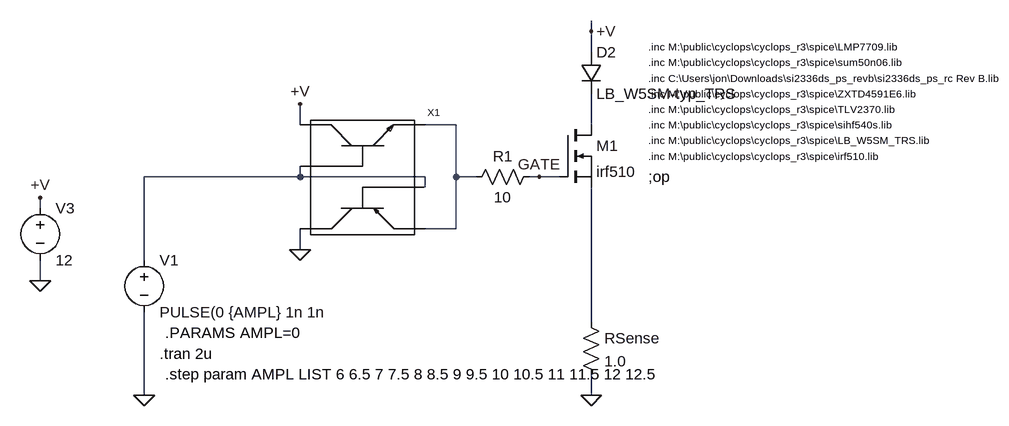
[diagram p0: schematic cyclops_r3.6_feedback-factor.asc]
cyclops_r3.6_feedback-factor.asc, the LTspice schematic file:
Version 4
SHEET 1 1460 980
WIRE 160 -48 160 -64
WIRE 160 -16 160 -48
WIRE -288 96 -288 64
WIRE -48 96 -96 96
WIRE 160 96 160 48
WIRE -288 176 -288 160
WIRE -288 176 -528 176
WIRE -96 176 -288 176
WIRE -48 176 -48 96
WIRE -16 176 -48 176
WIRE 80 176 64 176
WIRE 112 176 80 176
WIRE -96 192 -96 176
WIRE -688 224 -688 208
WIRE -48 256 -48 176
WIRE -48 256 -96 256
WIRE -288 288 -288 256
WIRE -528 304 -528 176
WIRE -688 336 -688 304
WIRE 160 400 160 192
WIRE -528 512 -528 384
WIRE 160 512 160 480
FLAG 160 512 0
FLAG -528 512 0
FLAG -688 336 0
FLAG -688 208 +V
FLAG 160 -48 +V
FLAG -288 64 +V
FLAG -288 288 0
FLAG 80 176 GATE
SYMBOL nmos 112 96 R0
SYMATTR InstName M1
SYMATTR Value irf510
SYMATTR Prefix X
SYMBOL res 144 384 R0
SYMATTR InstName RSense
SYMATTR Value 1.0
SYMATTR SpiceLine pwr=20
SYMBOL voltage -528 288 R0
WINDOW 123 0 0 Left 2
WINDOW 39 0 0 Left 2
SYMATTR InstName V1
SYMATTR Value PULSE(0 {AMPL} 1n 1n
SYMBOL voltage -688 208 R0
WINDOW 123 0 0 Left 2
WINDOW 39 0 0 Left 2
SYMATTR InstName V3
SYMATTR Value 12
SYMBOL ZXTD45 -192 176 R0
SYMATTR InstName X1
SYMATTR Prefix X
SYMATTR Value ZXTD4591E6
SYMBOL res 80 160 R90
WINDOW 0 0 56 VBottom 2
WINDOW 3 32 56 VTop 2
SYMATTR InstName R1
SYMATTR Value 10
SYMBOL diode 144 -16 R0
SYMATTR InstName D2
SYMATTR Value LB_W5SM-typ_TRS
TEXT 248 96 Left 1 !.inc M:\\public\\cyclops\\cyclops_r3\\spice\\sihf540s.lib
TEXT 248 176 Left 2 !;op
TEXT 248 120 Left 1 !.inc M:\\public\\cyclops\\cyclops_r3\\spice\\LB_W5SM_TRS.lib
TEXT 248 72 Left 1 !.inc M:\\public\\cyclops\\cyclops_r3\\spice\\TLV2370.lib
TEXT 248 48 Left 1 !.inc M:\\public\\cyclops\\cyclops_r3\\spice\\ZXTD4591E6.lib
TEXT 248 144 Left 1 !.inc M:\\public\\cyclops\\cyclops_r3\\spice\\irf510.lib
TEXT 248 24 Left 1 !.inc C:\\Users\\jon\\Downloads\\si2336ds_ps_revb\\si2336ds_ps_rc Rev B.lib
TEXT 248 0 Left 1 !.inc M:\\public\\cyclops\\cyclops_r3\\spice\\sum50n06.lib
TEXT 248 -24 Left 1 !.inc M:\\public\\cyclops\\cyclops_r3\\spice\\LMP7709.lib
TEXT -496 416 Left 2 !.PARAMS AMPL=0
TEXT -504 448 Left 2 !.tran 2u
TEXT -496 480 Left 2 !.step param AMPL LIST 6 6.5 7 7.5 8 8.5 9 9.5 10 10.5 11 11.5 12 12.5

The netlist it stands for:
* cyclops_r3.6_feedback-factor.asc
XM1 N002 GATE N004 irf510  ; pins D G S
RSense N004 0 1.0 pwr=20
V1 N003 0 PULSE(0 {AMPL} 1n 1n
V3 +V 0 12
XX1 +V N003 0 N001 N003 N001 ZXTD45 params: ZXTD4591E6  ; pins C1 B1 C2 E2 B2 E1
R1 GATE N001 10
D2 +V N002 LB_W5SM-typ_TRS
.model D D
.lib standard.dio
.inc M:\public\cyclops\cyclops_r3\spice\sihf540s.lib
;op
.inc M:\public\cyclops\cyclops_r3\spice\LB_W5SM_TRS.lib
.inc M:\public\cyclops\cyclops_r3\spice\TLV2370.lib
.inc M:\public\cyclops\cyclops_r3\spice\ZXTD4591E6.lib
.inc M:\public\cyclops\cyclops_r3\spice\irf510.lib
.inc C:\Users\jon\Downloads\si2336ds_ps_revb\si2336ds_ps_rc Rev B.lib
.inc M:\public\cyclops\cyclops_r3\spice\sum50n06.lib
.inc M:\public\cyclops\cyclops_r3\spice\LMP7709.lib
.PARAMS AMPL=0
.tran 2u
.step param AMPL LIST 6 6.5 7 7.5 8 8.5 9 9.5 10 10.5 11 11.5 12 12.5
.backanno
.end